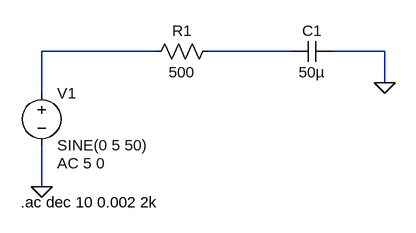
[diagram p0: schematic low_pass.asc]
low_pass.asc, the LTspice schematic file:
Version 4.1
SHEET 1 880 680
WIRE 112 48 -64 48
WIRE 320 48 192 48
WIRE 464 48 384 48
WIRE 464 96 464 48
WIRE -64 112 -64 48
WIRE -64 256 -64 192
FLAG 464 96 0
FLAG -64 256 0
DATAFLAG 256 48 ""
DATAFLAG 256 48 ""
SYMBOL voltage -64 96 R0
WINDOW 123 24 124 Left 2
WINDOW 39 0 0 Left 0
SYMATTR Value2 AC 5 0
SYMATTR InstName V1
SYMATTR Value SINE(0 5 50)
SYMBOL res 208 32 R90
WINDOW 0 0 56 VBottom 2
WINDOW 3 32 56 VTop 2
SYMATTR InstName R1
SYMATTR Value 500
SYMBOL cap 384 32 R90
WINDOW 0 0 32 VBottom 2
WINDOW 3 32 32 VTop 2
SYMATTR InstName C1
SYMATTR Value 50µ
TEXT -96 280 Left 2 !.ac dec 10 0.002 2k

The netlist it stands for:
* low_pass.asc
V1 N001 0 SINE(0 5 50) AC 5 0
R1 N002 N001 500
C1 0 N002 50µ
.ac dec 10 0.002 2k
.backanno
.end